# EAGLE design oresat-batteries-prototype (EAGLE 9.5.1)
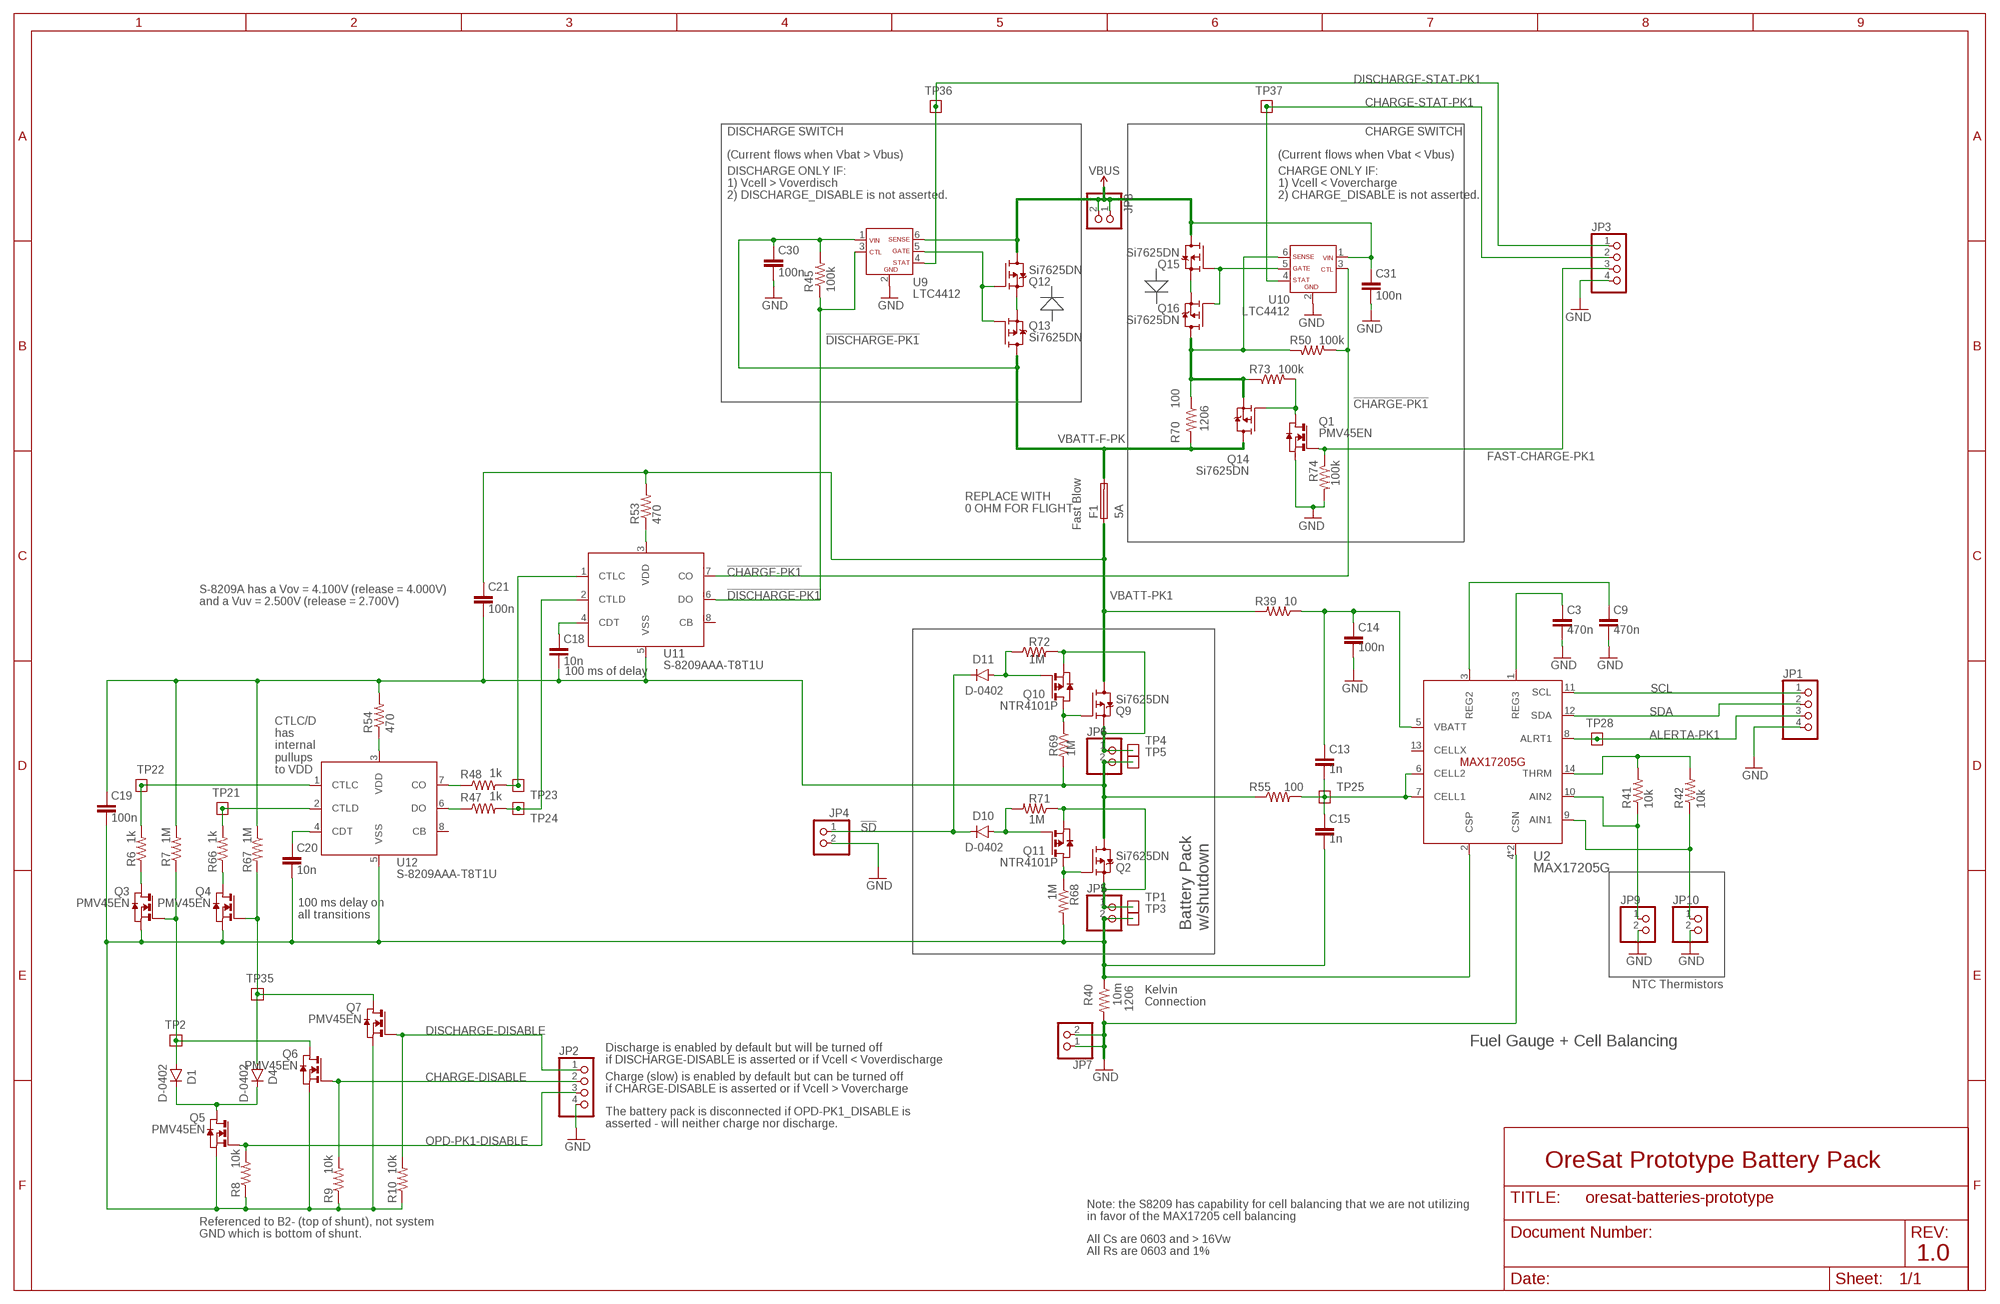
[diagram p0: schematic, sheet 1]

## Parts
C3  470n  C-EU0603-C-NOSILK  [.0603-C-NOSILK]
C9  470n  C-EU0603-C-NOSILK  [.0603-C-NOSILK]
C13  1n  C-EU0603-C-NOSILK  [.0603-C-NOSILK]
C14  100n  C-EU0603-C-NOSILK  [.0603-C-NOSILK]
C15  1n  C-EU0603-C-NOSILK  [.0603-C-NOSILK]
C18  10n  C-EU0603-C-NOSILK  [.0603-C-NOSILK]
C19  100n  C-EU0603-C-NOSILK  [.0603-C-NOSILK]
C20  10n  C-EU0603-C-NOSILK  [.0603-C-NOSILK]
C21  100n  C-EU0603-C-NOSILK  [.0603-C-NOSILK]
C30  100n  C-EU0603-C-NOSILK  [.0603-C-NOSILK]
C31  100n  C-EU0603-C-NOSILK  [.0603-C-NOSILK]
D1  D-0402  [.0402-B-NOSILK-DIODE]
D4  D-0402  [.0402-B-NOSILK-DIODE]
D10  D-0402  [.0402-B-NOSILK-DIODE]
D11  D-0402  [.0402-B-NOSILK-DIODE]
F1  5A  F-ERB_RE5R00V-FUSE  [C0603]
JP1  PINHD-1X4  [1X04]
JP2  PINHD-1X4  [1X04]
JP3  PINHD-1X4  [1X04]
JP4  PINHD-1X2  [1X02]
JP5  PINHD-1X2  [1X02]
JP6  PINHD-1X2  [1X02]
JP7  PINHD-1X2  [1X02]
JP8  PINHD-1X2  [1X02]
JP9  PINHD-1X2  [1X02]
JP10  PINHD-1X2  [1X02]
Q1  PMV45EN  [SOT23]
Q2  Si7625DN  Q-VISHAY-MOSFET-PCH-POWERPAK-1212-8  [POWERPAK-1212-8]
Q3  PMV45EN  [SOT23]
Q4  PMV45EN  [SOT23]
Q5  PMV45EN  [SOT23]
Q6  PMV45EN  [SOT23]
Q7  PMV45EN  [SOT23]
Q9  Si7625DN  Q-VISHAY-MOSFET-PCH-POWERPAK-1212-8  [POWERPAK-1212-8]
Q10  NTR4101P  [SOT23]
Q11  NTR4101P  [SOT23]
Q12  Si7625DN  Q-VISHAY-MOSFET-PCH-POWERPAK-1212-8  [POWERPAK-1212-8]
Q13  Si7625DN  Q-VISHAY-MOSFET-PCH-POWERPAK-1212-8  [POWERPAK-1212-8]
Q14  Si7625DN  Q-VISHAY-MOSFET-PCH-POWERPAK-1212-8  [POWERPAK-1212-8]
Q15  Si7625DN  Q-VISHAY-MOSFET-PCH-POWERPAK-1212-8  [POWERPAK-1212-8]
Q16  Si7625DN  Q-VISHAY-MOSFET-PCH-POWERPAK-1212-8  [POWERPAK-1212-8]
R6  1k  R-US_0603-C-NOSILK  [.0603-C-NOSILK]
R7  1M  R-US_0603-C-NOSILK  [.0603-C-NOSILK]
R8  10k  R-US_0603-C-NOSILK  [.0603-C-NOSILK]
R9  10k  R-US_0603-C-NOSILK  [.0603-C-NOSILK]
R10  10k  R-US_0603-C-NOSILK  [.0603-C-NOSILK]
R39  10  R-US_0603-C-NOSILK  [.0603-C-NOSILK]
R40  10m  R-US_1206-C  [1206-C]
R41  10k  R-US_0603-C-NOSILK  [.0603-C-NOSILK]
R42  10k  R-US_0603-C-NOSILK  [.0603-C-NOSILK]
R45  100k  R-US_0603-C-NOSILK  [.0603-C-NOSILK]
R47  1k  R-US_0603-C-NOSILK  [.0603-C-NOSILK]
R48  1k  R-US_0603-C-NOSILK  [.0603-C-NOSILK]
R50  100k  R-US_0603-C-NOSILK  [.0603-C-NOSILK]
R53  470  R-US_0603-C-NOSILK  [.0603-C-NOSILK]
R54  470  R-US_0603-C-NOSILK  [.0603-C-NOSILK]
R55  100  R-US_0603-C-NOSILK  [.0603-C-NOSILK]
R66  1k  R-US_0603-C-NOSILK  [.0603-C-NOSILK]
R67  1M  R-US_0603-C-NOSILK  [.0603-C-NOSILK]
R68  1M  R-US_0603-C-NOSILK  [.0603-C-NOSILK]
R69  1M  R-US_0603-C-NOSILK  [.0603-C-NOSILK]
R70  100  R-US_1206-C  [1206-C]
R71  1M  R-US_0603-C-NOSILK  [.0603-C-NOSILK]
R72  1M  R-US_0603-C-NOSILK  [.0603-C-NOSILK]
R73  100k  R-US_0603-C-NOSILK  [.0603-C-NOSILK]
R74  100k  R-US_0603-C-NOSILK  [.0603-C-NOSILK]
TP1  TEST-POINT  [2MM-TEST-POINT]
TP2  TEST-POINT  [2MM-TEST-POINT]
TP3  TEST-POINT  [2MM-TEST-POINT]
TP4  TEST-POINT  [2MM-TEST-POINT]
TP5  TEST-POINT  [2MM-TEST-POINT]
TP21  TEST-POINT  [2MM-TEST-POINT]
TP22  TEST-POINT  [2MM-TEST-POINT]
TP23  TEST-POINT  [2MM-TEST-POINT]
TP24  TEST-POINT  [2MM-TEST-POINT]
TP25  TEST-POINT  [2MM-TEST-POINT]
TP28  TEST-POINT  [2MM-TEST-POINT]
TP35  TEST-POINT  [2MM-TEST-POINT]
TP36  TEST-POINT  [2MM-TEST-POINT]
TP37  TEST-POINT  [2MM-TEST-POINT]
U2  MAX17205G  [21-0137I_T1433-2]
U9  LTC4412  [SOT23-6]
U10  LTC4412  [SOT23-6]
U11  S-8209AAA-T8T1U  S-8209AXXT  [TSSOP8]
U12  S-8209AAA-T8T1U  S-8209AXXT  [TSSOP8]

## Nets
!CHARGE-PK1: R50.1 U10.3(CTL) U11.7(CO)
!DISCHARGE-PK1: R45.1 U9.3(CTL) U11.6(DO)
!FAST-CHARGE-PK1: Q1.3(D) Q14.4(G) R73.2
!SD: D10.C D11.C JP4.1
AIN1-PK1: JP10.1 R42.1 U2.9(AIN1)
AIN2-PK1: JP9.1 R41.1 U2.10(AIN2)
ALERTA-PK1: JP1.3 TP28.1 U2.8(ALRT1)
CELL1-PK1: C13.2 C15.1 R55.2 TP25.1 U2.6(CELL2) U2.7(CELL1)
CHARGE-DISABLE: JP2.2 Q6.1(G) R9.2
CHARGE-STAT-PK1: JP3.2 TP37.1 U10.4(STAT)
CSP-PK1: C15.2 C19.2 C20.2 JP5.2 Q3.2(S) Q4.2(S) Q5.2(S) Q6.2(S) Q7.2(S) R8.1 R9.1 R10.1 R40.1 R68.2 TP3.1 U2.2(CSP) U12.5(VSS)
DISCHARGE-DISABLE: JP2.1 Q7.1(G) R10.2
DISCHARGE-STAT-PK1: JP3.1 TP36.1 U9.4(STAT)
FAST-CHARGE-PK1: JP3.3 Q1.1(G) R74.1
GND: C3.2 C9.2 C14.2 C30.2 C31.2 JP1.4 JP2.4 JP3.4 JP4.2 JP7.1 JP7.2 JP9.2 JP10.2 Q1.2(S) R40.2 R74.2 U2.4(CSN) U2.EP(CSN) U9.2(GND) U10.2(GND)
N$1: D1.C D4.C Q5.3(D)
N$2: R47.2 TP24.1 U11.2(CTLD)
N$3: R47.1 U12.6(DO)
N$4: R48.2 TP23.1 U11.1(CTLC)
N$5: Q4.3(D) R66.1
N$6: R48.1 U12.7(CO)
N$7: C20.1 U12.4(CDT)
N$8: Q12.4(G) Q13.4(G) U9.5(GATE)
N$9: Q12.1(S) Q12.2(S) Q12.3(S) Q13.1(S) Q13.2(S) Q13.3(S)
N$10: Q3.3(D) R6.1
N$11: D4.A Q4.1(G) Q7.3(D) R67.2 TP35.1
N$12: C18.1 U11.4(CDT)
N$14: R6.2 TP22.1 U12.1(CTLC)
N$15: Q9.4(G) Q10.3(D) R69.1
N$16: R53.1 U11.3(VDD)
N$17: R54.1 U12.3(VDD)
N$37: R66.2 TP21.1 U12.2(CTLD)
N$40: D10.A Q11.1(G) R71.2
N$41: Q14.1(S) Q14.2(S) Q14.3(S) Q16.5(D) Q16.6(D) Q16.7(D) Q16.8(D) Q16.PAD(D) R50.2 R70.1 R73.1 U10.6(SENSE)
N$42: JP6.1 Q9.1(S) Q9.2(S) Q9.3(S) Q10.2(S) R72.2 TP4.1
N$43: Q15.4(G) Q16.4(G) U10.5(GATE)
N$44: Q15.1(S) Q15.2(S) Q15.3(S) Q16.1(S) Q16.2(S) Q16.3(S)
N$46: Q2.4(G) Q11.3(D) R68.1
N$50: D11.A Q10.1(G) R72.1
N$51: D1.A Q3.1(G) Q6.3(D) R7.1 TP2.1
N$53: JP5.1 Q2.1(S) Q2.2(S) Q2.3(S) Q11.2(S) R71.1 TP1.1
N$54: C18.2 C19.1 C21.2 JP6.2 Q2.5(D) Q2.6(D) Q2.7(D) Q2.8(D) Q2.PAD(D) R7.2 R54.2 R55.1 R67.1 R69.2 TP5.1 U11.5(VSS)
OPD-PK1-DISABLE: JP2.3 Q5.1(G) R8.2
REG2-PK1: C9.1 U2.3(REG2)
REG3-PK1: C3.1 U2.1(REG3)
SCL: JP1.1 U2.11(SCL)
SDA: JP1.2 U2.12(SDA)
THRM-PK1: R41.2 R42.2 U2.14(THRM)
VBATT-F-PK: C30.1 F1.2 Q13.5(D) Q13.6(D) Q13.7(D) Q13.8(D) Q13.PAD(D) Q14.5(D) Q14.6(D) Q14.7(D) Q14.8(D) Q14.PAD(D) R45.2 R70.2 U9.1(VIN)
VBATT-PK1: C21.1 F1.1 Q9.5(D) Q9.6(D) Q9.7(D) Q9.8(D) Q9.PAD(D) R39.2 R53.2
VBATT-PL1: C13.1 C14.1 R39.1 U2.5(VBATT)
VBUS: C31.1 JP8.1 JP8.2 Q12.5(D) Q12.6(D) Q12.7(D) Q12.8(D) Q12.PAD(D) Q15.5(D) Q15.6(D) Q15.7(D) Q15.8(D) Q15.PAD(D) U9.6(SENSE) U10.1(VIN)
Unconnected: U2.13(CELLX) U11.8(CB) U12.8(CB)

## Notes on the sheet
- DISCHARGE SWITCH | CHARGE SWITCH
- (Current flows when Vbat > Vbus) | (Current flows when Vbat < Vbus)
- DISCHARGE ONLY IF:
  1) Vcell > Voverdisch
  2) DISCHARGE_DISABLE is not asserted.
- CHARGE ONLY IF:
  1) Vcell < Vovercharge
  2) CHARGE_DISABLE is not asserted.
- 1206
- REPLACE WITH 
  0 OHM FOR FLIGHT
- Fast Blow
- S-8209A has a Vov = 4.100V (release = 4.000V)
  and a Vuv = 2.500V (release = 2.700V)
- 100 ms of delay
- CTLC/D
  has 
  internal
  pullups
  to VDD
- 100 ms delay on 
  all transitions
- Battery Pack 
  w/shutdown
- NTC Thermistors
- Kelvin
  Connection
- 1206
- Fuel Gauge + Cell Balancing
- Discharge is enabled by default but will be turned off
  if DISCHARGE-DISABLE is asserted or if Vcell < Voverdischarge
- Charge (slow) is enabled by default but can be turned off
  if CHARGE-DISABLE is asserted or if Vcell > Vovercharge
- The battery pack is disconnected if OPD-PK1_DISABLE is
  asserted - will neither charge nor discharge.
- OreSat Prototype Battery Pack
- Note: the S8209 has capability for cell balancing that we are not utilizing 
  in favor of the MAX17205 cell balancing
- Referenced to B2- (top of shunt), not system 
  GND which is bottom of shunt.
- All Cs are 0603 and > 16Vw
  All Rs are 0603 and 1%
- 1.0

## Library data of the parts
C3 C9 C13-C15 C18-C21 C30 C31 = oresat-rcl:C-EU: CAPACITOR, European symbol
D1 D4 D10 D11 = D-0402-package:D-0402; MFR: Micro Commercial Co; MPN: 1N4148WL2-TP
F1 = F-Panasonic-ERB_RE5-Fuse:F-ERB_RE5R00V-FUSE; MFR: Panasonic; MPN: ERB-RE5R00V
JP1-JP3 = pinhead:PINHD-1X4: PIN HEADER
JP4-JP10 = pinhead:PINHD-1X2: PIN HEADER
Q1 Q3-Q7 = Tova:PMV45EN; MFR: Diodes Inc; MPN: DMG2302UK-7
Q2 Q9 Q12-Q16 = Q-VIshay-MOSFET-PCH-PowerPak121-8:Q-VISHAY-MOSFET-PCH-POWERPAK-1212-8; MFR: Vishay Siliconix; MPN: SI7625DN-T1-GE3
Q10 Q11 = Tova:NTR4101P; MFR: Diodes Inc; MPN: DMG3401LSN-7
R6-R10 R39-R42 R45 R47 R48 R50 R53-R55 R66-R74 = oresat-rcl:R-US_: RESISTOR, American symbol
TP1-TP5 TP21-TP25 TP28 TP35-TP37 = Tova:TEST-POINT
U2 = U-Maxim-MAX17205-Fuel_Gauge:MAX17205G; MFR: Maxim Integrated; MPN: MAX17205G+T
U9 U10 = U-LT-LTC4412-ideal-diode:LTC4412; MFR: Linear Technology; MPN: LTC4412HS6#TRMPBF
U11 U12 = U-ABLIC-s8209A-BattProtection:S-8209AXX; MFR: Ablic; MPN: S-8209AAA-T8T1U

## Board
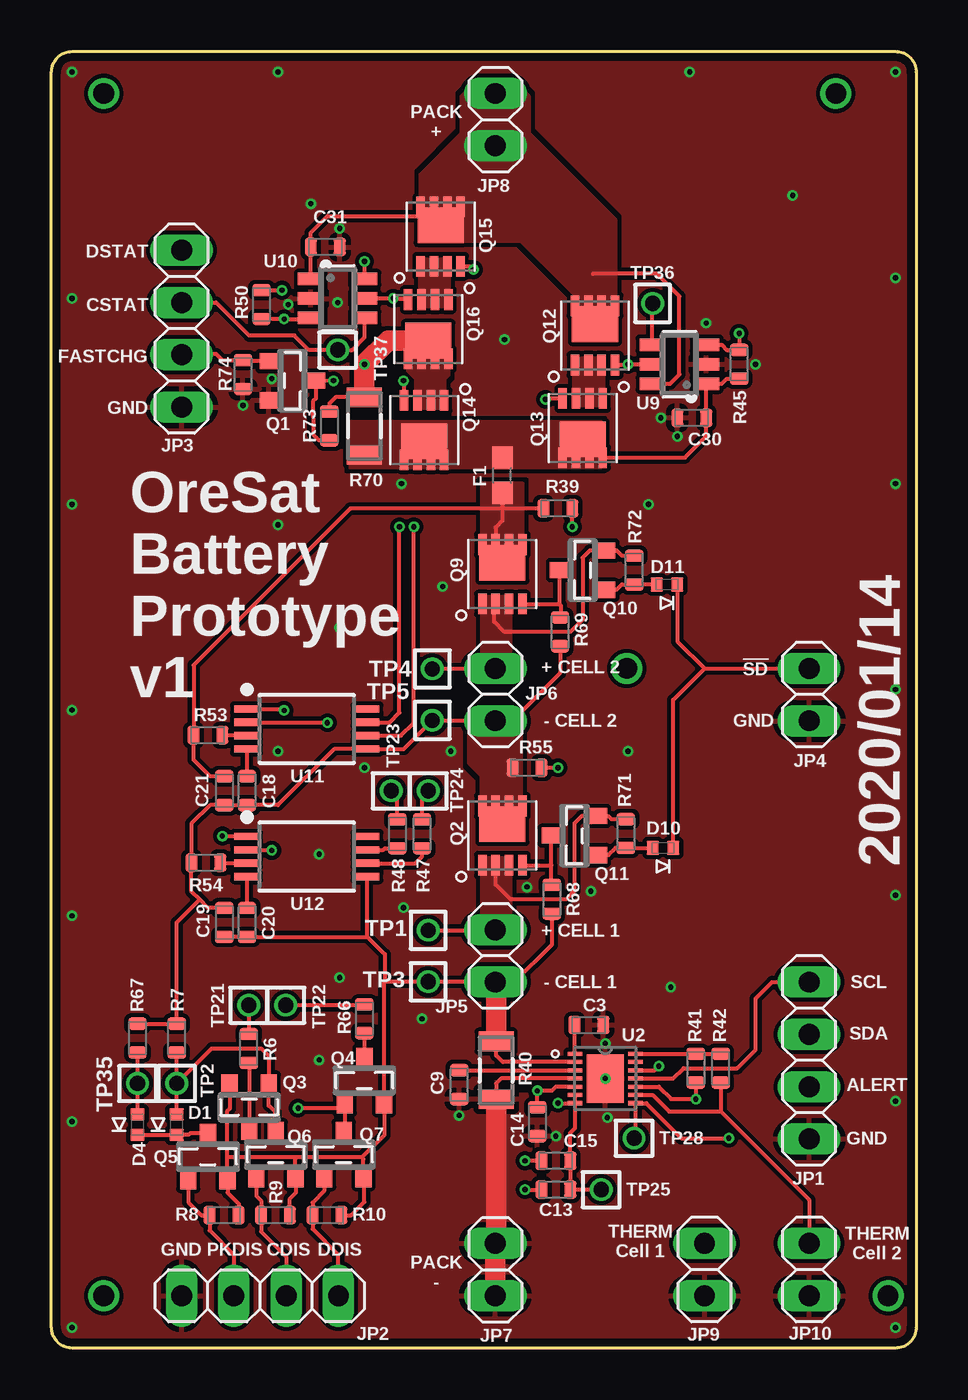
[diagram p1: board, top side]
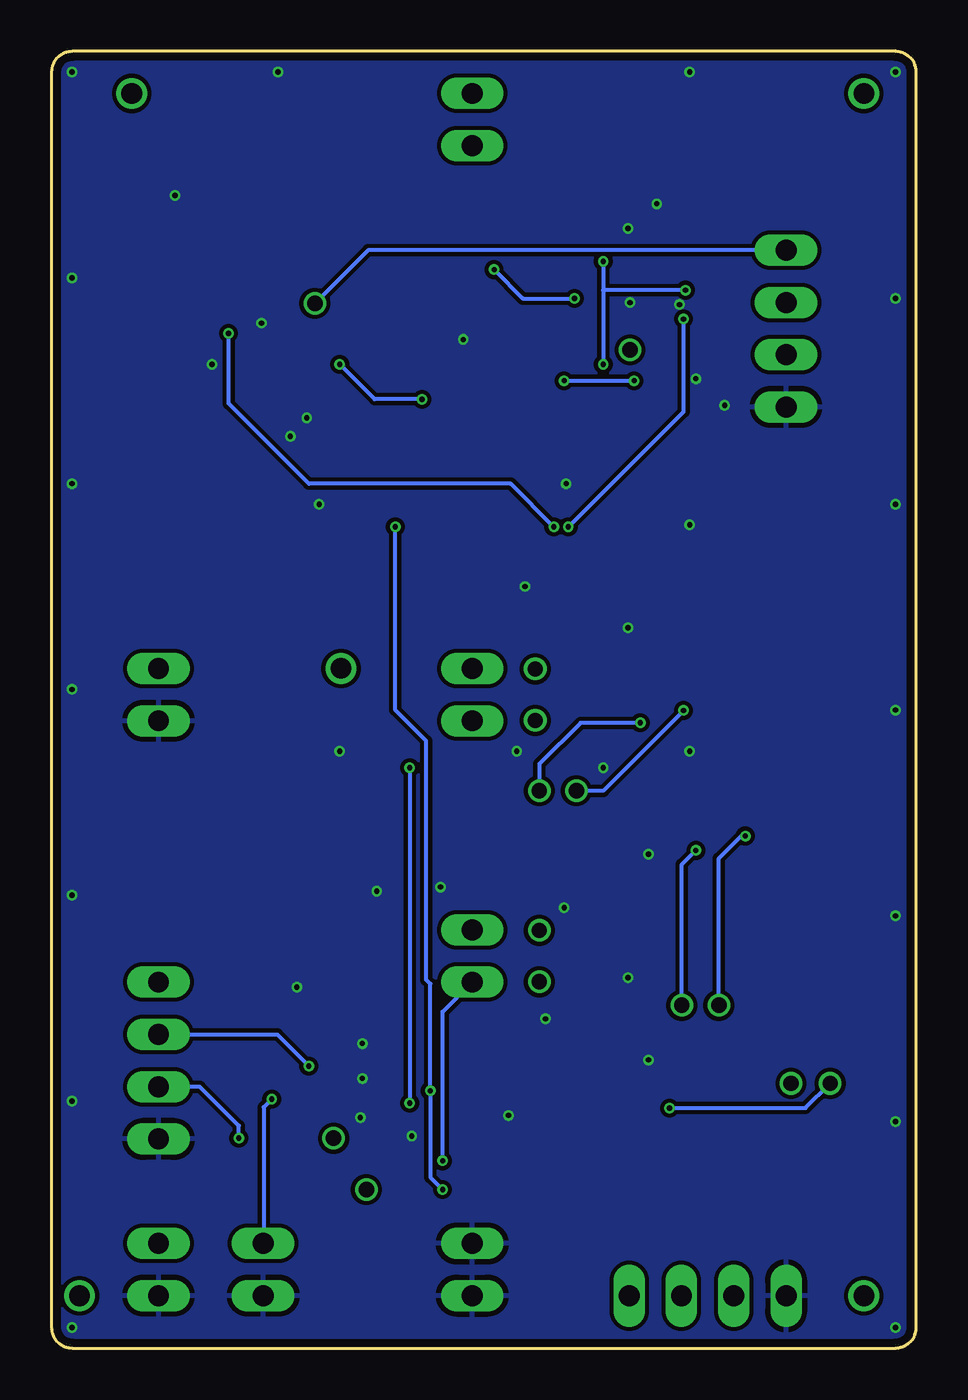
[diagram p2: board, bottom side, seen from below]

Size 42 x 63 mm. Coordinates in mm from the lower left corner, seen from the top.
Outline: 41,0 1,0 arc-90 0,1 0,62 arc-90 1,63 41,63 arc-90 42,62 42,1 arc-90 41,0
Copper layers (1*16): Top 0.035559375mm / dielectric 1.6mm / Bottom 0.035559375mm
Design rules "oshpark-2layer *": minimum track width 6mil, minimum drill 10mil, track to track 6mil, track to pad 6mil, pad to pad 6mil, via to via 6mil, smd to smd 6mil, copper to edge 15mil, drill to drill 6mil, minimum pad ring 5mil, minimum via ring 5mil, stop-mask expansion 2.5mil, vias tented up to drill 10mil, thermal gap 10mil
tRestrict: 6 lines

### Footprints (pad centres in the part's own frame; a part is rotated, then mirrored left to right if it is on the bottom)
.0603-C-NOSILK = smd 0.6 x 0.9: 1 -0.7,0; 2 0.7,0
.0402-B-NOSILK-DIODE = smd 0.6 x 0.7: A -0.5,0; C 0.5,0
C0603 = smd 1.1 x 1: 1 -0.85,0; 2 0.85,0
1X04 = drill 1.016 long: 1 -3.81,0; 2 -1.27,0; 3 1.27,0; 4 3.81,0
1X02 = drill 1.016 long: 1 -1.27,0; 2 1.27,0
SOT23 = smd 0.787 x 0.889: 1 -0.953,-1.143; 2 0.953,-1.143; 3 0,1.143
POWERPAK-1212-8 = smd 0.41 x 1: 1 -0.975,-1.44; 2 -0.325,-1.44; 3 0.325,-1.44; 4 0.975,-1.44; 5 -0.975,1.44; 6 -0.325,1.44; 7 0.325,1.44; 8 0.975,1.44 | smd 2.24 x 1.73: PAD 0,0.55
1206-C = smd 0.95 x 1.7: 1 -1.4,0; 2 1.4,0
2MM-TEST-POINT = drill 0.737: 1 0,0
21-0137I_T1433-2 = smd 0.7 x 0.2: 1 -1.475,1.2; 2 -1.475,0.8; 3 -1.475,0.4; 4 -1.475,0; 5 -1.475,-0.4; 6 -1.475,-0.8; 7 -1.475,-1.2; 8 1.475,-1.2; 9 1.475,-0.8; 10 1.475,-0.4; 11 1.475,0; 12 1.475,0.4; 13 1.475,0.8; 14 1.475,1.2 | smd 1.78 x 2.35: EP 0,0
SOT23-6 = smd 0.6 x 1.25: 1 0.95,1.31; 2 0,1.31; 3 -0.95,1.31; 4 -0.95,-1.31; 5 0,-1.31; 6 0.95,-1.31
TSSOP8 = smd 1.2 x 0.35: 1 -2.925,0.975; 2 -2.925,0.325; 3 -2.925,-0.325; 4 -2.925,-0.975; 5 2.925,-0.975; 6 2.925,-0.325; 7 2.925,0.325; 8 2.925,0.975

### Placement (x,y rotation side)
C3  26.1,15.7 0 top
C9  19.8,12.8 270 top
C13  24.5,7.7 0 top
C14  23.6,11 270 top
C15  24.5,9.1 180 top
C18  9.5,27.08 270 top
C19  8.4,20.68 270 top
C20  9.5,20.68 270 top
C21  8.4,27.08 270 top
C30  31.1,45.2 180 top
C31  13.3,53.5 0 top
D1  6.08,10.86 270 top
D4  4.18,10.86 270 top
D10  29.7,24.3 0 top
D11  29.9,37.1 0 top
F1  21.9,42.4 90 top
JP1  36.8,13.97 270 top
JP2  10.13,2.54 180 top
JP3  6.32,49.53 270 top
JP4  36.8,31.75 270 top
JP5  21.56,19.05 270 top
JP6  21.56,31.75 270 top
JP7  21.56,3.81 90 top
JP8  21.56,59.69 90 top
JP9  31.72,3.81 270 top
JP10  36.8,3.81 270 top
Q1  11.7,47 270 top
Q2  21.9,24.9 0 top
Q3  9.6,11.7 180 top
Q4  15.2,13 0 top
Q5  7.6,9.3 0 top
Q6  10.9,9.4 0 top
Q7  14.2,9.4 0 top
Q9  21.9,37.6 0 top
Q10  25.8,37.8 90 top
Q11  25.4,24.9 90 top
Q12  26.4,49.2 0 top
Q13  25.8,44.7 180 top
Q14  18.1,44.6 180 top
Q15  18.9,54 0 top
Q16  18.3,49.5 180 top
R6  9.58,14.56 90 top
R7  6.08,15.06 90 top
R8  8.38,6.46 180 top
R9  10.88,6.46 180 top
R10  13.38,6.46 180 top
R39  24.6,40.8 180 top
R40  21.6,13.5 270 top
R41  31.3,13.6 90 top
R42  32.5,13.6 90 top
R45  33.4,47.8 270 top
R47  18,24.98 90 top
R48  16.8,24.98 90 top
R50  10.2,50.7 90 top
R53  7.6,29.78 180 top
R54  7.5,23.58 180 top
R55  23.1,28.2 0 top
R66  15.2,16 90 top
R67  4.18,15.06 270 top
R68  24.3,21.8 270 top
R69  24.7,34.8 270 top
R70  15.2,44.8 270 top
R71  27.9,25 270 top
R72  28.3,37.8 90 top
R73  13.5,44.8 270 top
R74  9.3,47.3 270 top
TP1  18.3,20.3 0 top
TP2  6.08,12.86 90 top
TP3  18.3,17.8 0 top
TP4  18.5,33 0 top
TP5  18.5,30.5 0 top
TP21  11.38,16.66 90 top
TP22  9.58,16.66 270 top
TP23  16.5,27.08 90 top
TP24  18.3,27.08 90 top
TP25  26.7,7.7 90 top
TP28  28.3,10.2 90 top
TP35  4.18,12.86 90 top
TP36  29.2,50.76 180 top
TP37  13.9,48.5 270 top
U2  26.9,13.1 0 top
U9  30.5,47.8 270 top
U10  13.9,51 90 top
U11  12.4,30.08 0 top
U12  12.4,23.88 0 top

### Tracks (layer width: path | path; a pad name or v marks a point on that pad's centre or on a via)
!CHARGE-PK1  (via drill 0.25)
  Top 0.2: U11.7 16.43,30.41 16.9,30.88 v16.9,39.9 | U10.3 12.54,50 v11.3,50 R50.1
  Bottom 0.2: v16.9,39.9 11.3,45.5 v11.3,50
!DISCHARGE-PK1  (via drill 0.25)
  Top 0.2: U11.6 16.98,29.75 17.6,30.38 v17.6,39.9 | U9.3 32.55,48.75 32.8,48.5 R45.1 v33.4,49.3
  Bottom 0.2: v17.6,39.9 19.7,42 29.5,42 33.4,45.9 v33.4,49.3
!FAST-CHARGE-PK1  (via drill 0.25)
  Top 0.2: Q14.4 17.12,46.98 v17.1,47 | R73.2 13,44.1 12.72,44.38 12.7,46 12.84,46.14 Q1.3 13.68,47.02 v13.7,47
  Bottom 0.2: v17.1,47 v13.7,47
!SD
  Top 0.2: D10.C 30.2,31.5 31.72,33.02 | 31.72,33.02 JP4.1 | D11.C 30.4,34.34 31.72,33.02
AIN1-PK1
  Top 0.2: U2.9 29.2,12.3 30,11.5 32.5,11.5 | JP10.1 36.8,7.2 32.5,11.5 | R42.1 32.5,11.5
AIN2-PK1  (via drill 0.25)
  Top 0.2: U2.10 29.5,12.7 30.1,12.1 v31.3,12.1 R41.1
  Bottom 0.2: v31.3,12.1 31.7,11.7 31.7,5.1 JP9.1
ALERTA-PK1  (via drill 0.25)
  Top 0.2: TP28.1 28.3,10.36 28.38,10.44 U2.8 28.9,11.9 30.6,10.2 v32.9,10.2
  Bottom 0.2: v32.9,10.2 32.9,10.8 34.8,12.7 JP1.3
CELL1-PK1  (via drill 0.25)
  Top 0.2: U2.6 U2.7 | U2.7 25.43,10.69 25.18,10.44 25.2,10.41 C15.1 C13.2 TP25.1 | R55.2 v24.6,28.2 | v24.6,11.9 U2.7
  Bottom 0.2: v24.6,28.2 v24.6,11.9
CHARGE-DISABLE
  Top 0.2: JP2.2 11.4,4.44 10.18,5.66 R9.2 10.18,7.16 9.95,7.39 Q6.1
CHARGE-STAT-PK1
  Top 0.2: U10.4 15.21,49.11 14.6,48.5 TP37.1 12.5,48.5 11.8,49.2 9.6,49.2 8,50.8 JP3.2
CSP-PK1  (via drill 0.25)
  Top 0.2: U2.2 21.92,13.9 21.6,14.22 R40.1 | C15.2 v23,9.1 | R68.2 24.3,19.6 22.44,17.74 21.6,17.74 | C19.2 C20.2 15.3,19.98 15.32,20 | R9.1 11.58,7.26 11.88,7.56 11.88,8.23 Q6.2 11.85,9.21 11.9,9.26 | U12.5 15.32,20 | 16.2,17.78 16.2,19.13 15.32,20 | 16.2,17.78 16.15,17.74 Q4.2 16.15,10.33 15.08,9.26 | R10.1 14.56,6.46 15.2,7.1 15.2,8.21 Q7.2 15.15,9.19 15.08,9.26 | Q5.2 8.55,8 | 8.55,8 8.55,7.55 9.1,7 9.1,6.48 R8.1 | 8.52,9.2 8.52,11.5 8.65,11.63 Q3.2 | 8.52,9.2 8.52,8.03 8.55,8 | 15.08,9.26 11.9,9.26 | 11.9,9.26 8.58,9.26 8.52,9.2 | JP5.2 18.32,17.78 TP3.1 18.28,17.78 16.2,17.78
  Top 1: JP5.2 21.6,17.74 R40.1
  Bottom 0.2: v23,9.1 23,16.34 JP5.2
DISCHARGE-DISABLE
  Top 0.2: JP2.1 13.94,4.54 12.69,5.79 R10.2 12.68,7.06 13.25,7.63 Q7.1
DISCHARGE-STAT-PK1
  Top 0.2: U9.4 29.19,50.74 TP36.1
  Bottom 0.2: JP3.1 26.62,53.34 TP36.1
FAST-CHARGE-PK1
  Top 0.2: JP3.3 6.36,48.3 8,48.3 8.3,48 R74.1 9.35,47.95 Q1.1
GND  (via drill 0.25)
  Top 0.2: U2.4 21.84,13.1 21.6,12.86 R40.2
  Top 1: R40.2 21.6,5.12 JP7.2 JP7.1
  other vias: 41,62 30.08,17.54 12.6,55.6 36,56 29.6,45.2 30.4,44.3 1,62 1,1 41,1 17.1,21.4 18,16 13,14 14,18 13,24 11,29 28,29 19,37 14,35 11,40 17,42 29,41 22,49 11,62 31,62 41,52 41,42 41,32 41,22 41,12 1,11 1,21 1,31 1,41 1,51 19.8,11.3 24.5,10.3 26.9,13.1 27,11.2 26.9,14.8 34.2,47.8 31.8,49.8 13.9,50.8 11.5,50.7 14,54.4 10.7,47.1 9.3,45.8 23.1,22.4 26.2,22.2 19.4,29 15.2,28.2
  pour Top (isolate 0.2, rank 6): 0,62 0,1 arc90 1,0 41,0 arc90 42,1 42,62 arc90 41,63 1,63 arc90
  pour Bottom (isolate 0.2, rank 6): 0,62 0,1 arc90 1,0 41,0 arc90 42,1 42,62 arc90 41,63 1,63 arc90
N$1
  Top 0.2: Q5.3 6.74,10.44 6.66,10.36 D1.C D4.C
N$2  (via drill 0.25)
  Top 0.2: R47.2 18,26.78 TP24.1 | U11.2 13.38,30.41 v13.4,30.38
  Bottom 0.2: v13.4,30.38 16.3,30.38 18.3,28.38 TP24.1
N$3
  Top 0.2: U12.6 17.68,23.55 18,23.88 R47.1
N$4  (via drill 0.25)
  Top 0.2: R48.2 16.8,26.78 TP23.1 | U11.1 11.22,31.05 v11.3,30.98
  Bottom 0.2: v11.3,30.98 15.2,27.08 TP23.1
N$5
  Top 0.2: R66.1 Q4.3
N$6
  Top 0.2: U12.7 16.12,24.2 16.2,24.28 R48.1
N$7
  Top 0.2: U12.4 9.47,21.41 C20.1
N$8  (via drill 0.25)
  Top 0.2: Q13.4 24.04,46.14 v24,46.1 | Q12.4 27.96,47.76 v28,47.8 U9.5
  Bottom 0.2: v24,46.1 26.3,46.1 v28,47.8
N$9
  pour Top (no thermals): 25.4,45.8 25.4,48.1 26.8,48.1 26.8,45.8
N$10
  Top 0.2: R6.1 9.6,13.84 Q3.3
N$11  (via drill 0.25)
  Top 0.2: D4.A TP35.1 R67.2 | v11.98,11.66 14.22,11.66 Q4.1 14.25,10.59 Q7.3
  Bottom 0.2: v11.98,11.66 5.38,11.66 TP35.1
N$12
  Top 0.2: U11.4 9.47,27.8 C18.1
N$13  (via drill 1)
  other vias: 2.54,2.54
N$14  (via drill 0.25)
  Top 0.2: U12.1 8.32,24.86 v8.3,24.88 | TP22.1 R6.2
  Bottom 0.2: TP22.1 9.58,23.8 8.5,24.88 v8.3,24.88
N$15
  Top 0.2: R69.1 24.73,35.52 24.73,36.1 24.66,36.16 | Q9.4 24.66,36.16 | Q10.3 24.66,36.17 24.66,36.16
N$16
  Top 0.2: U11.3 8.32,29.75 R53.1
N$17
  Top 0.2: U12.3 8.22,23.55 R54.1
N$18  (via drill 1)
  other vias: 40.64,2.54
N$19  (via drill 1)
  other vias: 2.54,60.96
N$20  (via drill 1)
  other vias: 38.1,60.96
N$21  (via drill 1)
  other vias: 27.94,33.02
N$37  (via drill 0.25)
  Top 0.2: U12.2 10.68,24.2 v10.7,24.18 | R66.2 15.16,16.66 TP21.1
  Bottom 0.2: TP21.1 11.38,23.5 v10.7,24.18
N$40
  Top 0.2: Q11.1 27.05,23.95 27.4,24.3 R71.2 D10.A
N$41  (via drill 0.25)
  Top 0.2: Q16.6 18.3,48.38 Q16.PAD | R70.1 13.8,46.2 13.5,45.9 R73.1 | U10.6 v15.21,52.79 v15.2,52.8 | R50.2 v11.2,51.4
  Top 1: R70.1 v15.2,47.8 16.35,48.95 Q16.PAD
  Bottom 0.2: v15.2,52.8 15.2,51.4 | 15.2,51.4 v15.2,47.8 | v11.2,51.4 15.2,51.4
  pour Top (no thermals): 19.1,45.7 19.1,47.1 19.3,47.3 19.3,49.6 17.3,49.6 17.3,47.5 17.7,47.1 17.7,45.7
N$42
  Top 0.2: Q9.2 21.5,36.09 21.5,35.3 22,34.8 25.2,34.8 25.8,35.4 25.8,38.4 26.15,38.75 Q10.2 27.45,38.75 27.7,38.5 R72.2 | JP6.1 21.54,33 TP4.1
  pour Top (no thermals): 20.9,32.6 22.3,32.6 22.3,36.5 20.9,36.5
N$43  (via drill 0.25)
  Top 0.2: Q15.4 20.44,52.56 20.5,52.5 v20.5,52.4 | Q16.4 17.27,51 v16.6,51 U10.5
  Bottom 0.2: v20.5,52.4 19.1,51 v16.6,51
N$44
  pour Top (no thermals): 17.9,50.6 17.9,52.9 19.3,52.9 19.3,50.6
N$46
  Top 0.2: Q2.4 24.29,23.46 | R68.1 24.29,22.52 24.29,23.46 | Q11.3 24.26,23.49 24.29,23.46
N$50
  Top 0.2: Q10.1 27.45,36.85 27.7,37.1 R72.1 D11.A
N$51
  Top 0.2: D1.A TP2.1 | TP2.1 R7.1 | TP2.1 7.78,14.56 10.18,14.56 10.55,14.19 Q3.1 10.55,11.79 10.87,11.47 10.87,10.58 Q6.3
N$53
  Top 0.2: Q2.2 21.57,22.52 22.3,21.8 25,21.8 25.4,22.2 25.4,25.5 25.75,25.85 Q11.2 27.05,25.85 27.2,25.7 R71.1 | TP1.1 21.54,20.3 21.57,20.34
  Top 1: 21.57,20.34 JP5.1
  pour Top (no thermals): 22.3,20 22.3,23.8 20.9,23.8 20.9,20
N$54
  Top 0.2: R69.2 24.7,32.8 22.38,30.48 JP6.2 | C19.1 7.6,21.38 7.19,21.79 | 7.19,21.79 6.8,22.18 R54.2 6.8,25.48 7.7,26.38 C21.2 C18.2 11,26.38 13.72,29.11 U11.5 17.11,29.11 TP5.1 18.52,30.48 JP6.2 | 21.9,25.2 21.6,25.2 22.23,25.82 Q2.7 | R67.1 R7.2 6.08,20.68 7.19,21.79 | 21.54,30.5 JP6.2
  pour Top (no thermals): 20.9,25 20.9,25 20.9,27.8 20.3,28.4 20.3,30.8 22.8,30.8 22.8,25
OPD-PK1-DISABLE
  Top 0.2: JP2.3 8.86,4.54 7.68,5.72 R8.2 7.28,6.46 6.65,7.09 Q5.1
REG2-PK1
  Top 0.2: C9.1 U2.3
REG3-PK1
  Top 0.2: U2.1 25.43,15.7 C3.1
SCL
  Top 0.2: JP1.1 35,17.78 34.2,16.98 34.2,14.5 33.3,13.6 30.7,13.6 30.2,13.1 U2.11
SDA  (via drill 0.25)
  Top 0.2: U2.12 29.3,13.5 v29.5,13.7
  Bottom 0.2: v29.5,13.7 31.04,15.24 JP1.2
THRM-PK1
  Top 0.2: U2.14 R41.2 R42.2
VBATT-F-PK
  Top 0.2: Q13.5 30.76,43.26 31.8,44.3 C30.1 U9.1 32.55,46.85 32.8,47.1 R45.2
  pour Top (no thermals): 14.5,42.8 26.7,42.8 26.7,45 14.5,45
VBATT-PK1
  Top 0.2: C21.1 7.7,27.78 6.9,28.58 R53.2 6.9,33.18 14.52,40.8 21.9,40.8 | F1.1 21.9,40.8 | R39.2 21.9,40.8 | 21.9,40.8 21.9,40.2 21.57,39.88 Q9.6
  pour Top (no thermals): 20.9,37.6 22.9,37.6 22.9,42 20.9,42
VBATT-PL1  (via drill 0.25)
  Top 0.2: U2.5 24.5,12.7 24.3,12.5 v23.6,12.5 C14.1 | v23,7.7 C13.1 | v25.3,39.9 R39.1
  Bottom 0.2: v23,7.7 23.6,8.3 v23.6,12.5 23.6,17.7 23.8,17.9 23.8,29.5 25.3,31 v25.3,39.9
VBUS
  Top 0.2: U9.6 30.05,46.85 30.5,47.3 30.5,51.1 29.4,52.2 26.3,52.2 | U10.1 C31.1 12.6,54.2 13.4,55 18.79,55 Q15.7
  pour Top (no thermals): 27.4,49 27.4,54.8 23.2,59 23.2,60.8 22.5,61.5 20.6,61.5 19.9,60.8 19.9,59 17.9,57 17.9,53.8 22.8,53.8 25.4,51.2 25.4,49

### Text on the board
tPlace: PACK / + | DSTAT | CSTAT | FASTCHG | GND | + CELL 2 | !SD | OreSat / Battery / Prototype / v1 | - CELL 2 | GND | 2020/01/14 | + CELL 1 | - CELL 1 | SCL | SDA | ALERT | GND | GND | PKDIS | CDIS | DDIS | THERM / Cell 1 | THERM / Cell 2 | PACK / -